# Altium schematic sheet ETH-W5500.SchDoc
size A; SheetNumber: 2; SheetTotal: 5
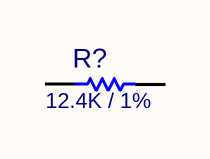
[diagram p0: ETH-W5500.SchDoc]

## Parts
R?  12.4K / 1%  [R0603]

## Nets

Not connected (* = marked no-connect by the designer): R? 1 2

## Library data of the parts
R? = RES_SMD: RESISTOR, SMD; PARAM: -W; DESC: DESCRIPTION; DIST#: MOUSER; MANF_P#: -; MANF: -; ASSEMBLY: ASSEMBLY; PRICE: 100= 0.5$; PARAM2: 1%; VALUE: 12.4K / 1%